# EAGLE design pca9535bo (EAGLE 6.2)
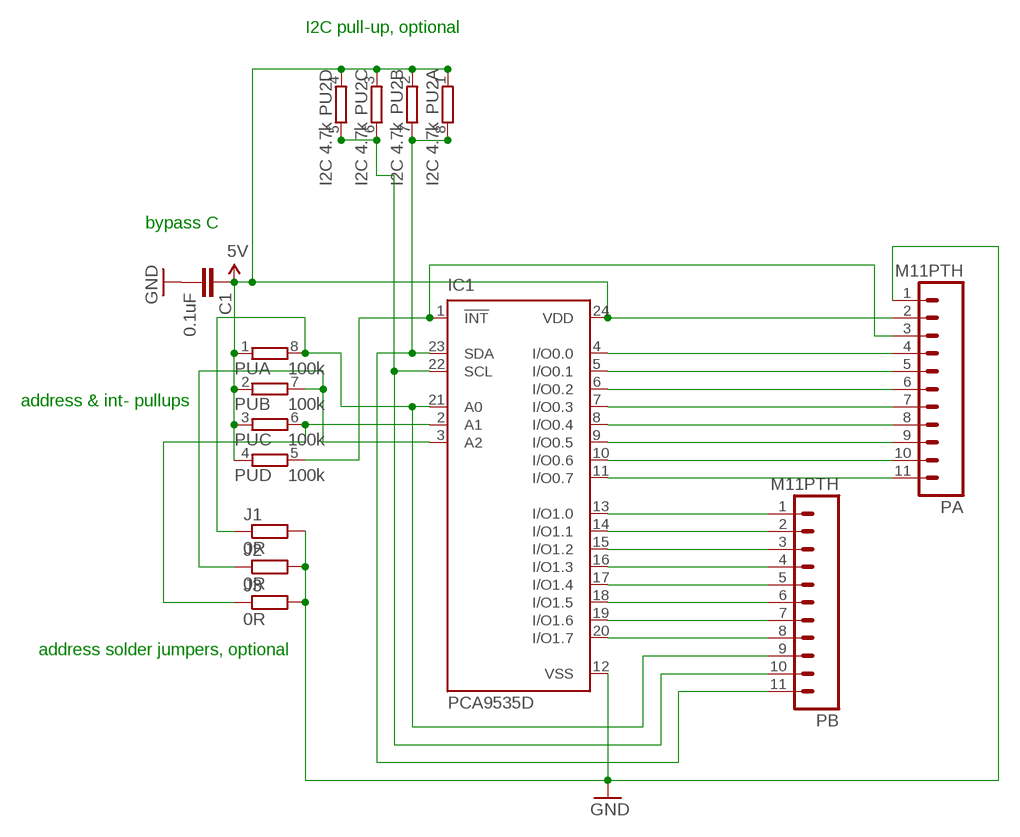
[diagram p0: schematic, sheet 1]

## Parts
C1  0.1uF  C-EUC0805K  [C0805K]
IC1  PCA9535D  PCA9555D  [SO24]
J1  0R  R-EU_R0603  [R0603]
J2  0R  R-EU_R0603  [R0603]
J3  0R  R-EU_R0603  [R0603]
PA  M11PTH  [1X11]
PB  M11PTH  [1X11]
PU  100k  4R-NCAY16  [CAY16]
PU2  I2C 4.7k  4R-NCAY16  [CAY16]

## Nets
5V: C1.1 IC1.24(VDD) PA.2 PU2.1 PU2.2 PU2.3 PU2.4 PU.1 PU.2 PU.3 PU.4
A0: IC1.21(A0) J1.1 PB.9 PU.8
A1: IC1.2(A1) J3.1 PU.6
A2: IC1.3(A2) J2.1 PU.7
GND: C1.2 IC1.12(VSS) J1.2 J2.2 J3.2 PA.1
INT-: IC1.1(!INT) PA.3 PU.5
PA0: IC1.4(I/O0.0) PA.4
PA1: IC1.5(I/O0.1) PA.5
PA2: IC1.6(I/O0.2) PA.6
PA3: IC1.7(I/O0.3) PA.7
PA4: IC1.8(I/O0.4) PA.8
PA5: IC1.9(I/O0.5) PA.9
PA6: IC1.10(I/O0.6) PA.10
PA7: IC1.11(I/O0.7) PA.11
PB0: IC1.13(I/O1.0) PB.1
PB1: IC1.14(I/O1.1) PB.2
PB2: IC1.15(I/O1.2) PB.3
PB3: IC1.16(I/O1.3) PB.4
PB4: IC1.17(I/O1.4) PB.5
PB5: IC1.18(I/O1.5) PB.6
PB6: IC1.19(I/O1.6) PB.7
PB7: IC1.20(I/O1.7) PB.8
SCL: IC1.22(SCL) PB.10 PU2.5 PU2.6
SDA: IC1.23(SDA) PB.11 PU2.7 PU2.8

## Notes on the sheet
- I2C pull-up, optional
- bypass C
- address & int- pullups
- address solder jumpers, optional

## Library data of the parts
C1 = rcl:C-EU: CAPACITOR, European symbol
IC1 = micro-philips:PCA9555: 16-bit I2C and SMBus I/O port with interrupt Source: PCA9555_5.pdf; MPN: PCA9555DW; OC_FARNELL: 1408295; OC_NEWARK: 63K6067
J1-J3 = resistor:R-EU_: RESISTOR, European symbol
PA PB = SparkFun:M11: Header 11 Standard 11-pin 0.1" header. Use with straight break away headers (SKU : PRT-00116), right angle break away headers (PRT-00553), swiss pins (PRT-00743), machine pins (PRT-00117), and female headers (PRT-00115).
PU PU2 = resistor-dil:4R-N: Array Chip Resistor Source: RS Component / Phycomp; OC_FARNELL: unknown; OC_NEWARK: unknown

## Net classes
1 power: width 0.152 mm

## Board
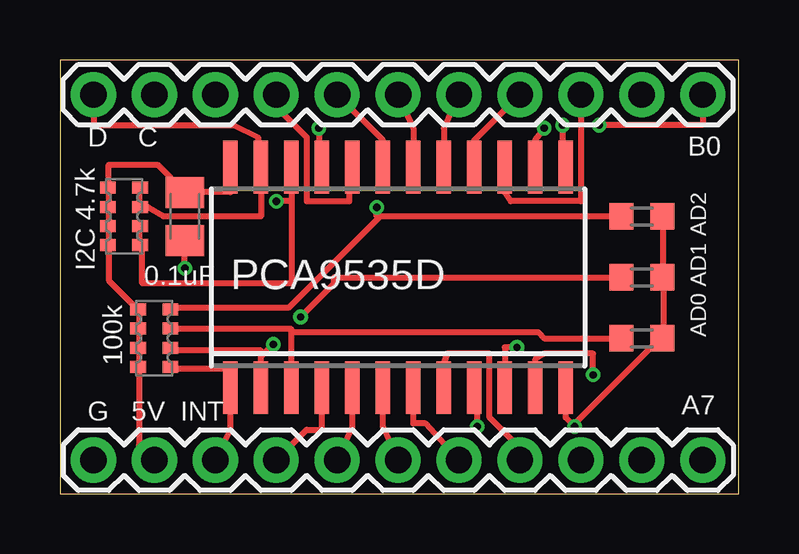
[diagram p1: board, top side]
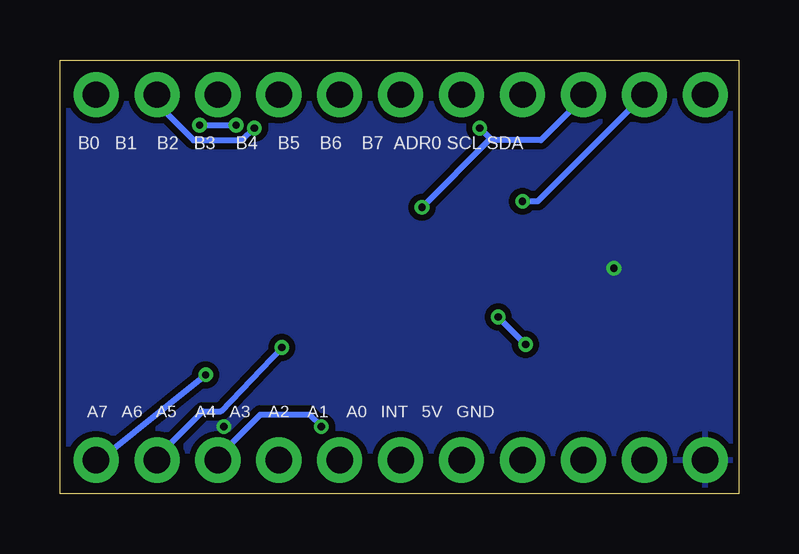
[diagram p2: board, bottom side, seen from below]

Size 28.3 x 18.09 mm. Coordinates in mm from the lower left corner, seen from the top.
Outline: 0,0 28.3,0 28.3,18.09 0,18.09 0,0
Copper layers (1*16): Top 0.035mm / dielectric 1.5mm / Bottom 0.035mm
Design rules: minimum track width 10mil, minimum drill 12mil, track to track 6mil, track to pad 6mil, pad to pad 6mil, via to via 6mil, smd to smd 0mil, copper to edge 10mil, drill to drill 10mil, minimum pad ring 10mil, minimum via ring 6mil, stop-mask expansion 2mil, vias tented up to drill 100mil, thermal gap 10mil

### Footprints (pad centres in the part's own frame; a part is rotated, then mirrored left to right if it is on the bottom)
C0805K = smd 1.3 x 1.6: 1 -1,0; 2 1,0
SO24 = smd 0.6 x 2.2: 1 -6.985,-4.6; 2 -5.715,-4.6; 3 -4.445,-4.6; 4 -3.175,-4.6; 5 -1.905,-4.6; 6 -0.635,-4.6; 7 0.635,-4.6; 8 1.905,-4.6; 9 3.175,-4.6; 10 4.445,-4.6; 11 5.715,-4.6; 12 6.985,-4.6; 13 6.985,4.6; 14 5.715,4.6; 15 4.445,4.6; 16 3.175,4.6; 17 1.905,4.6; 18 0.635,4.6; 19 -0.635,4.6; 20 -1.905,4.6; 21 -3.175,4.6; 22 -4.445,4.6; 23 -5.715,4.6; 24 -6.985,4.6
R0603 = smd 1 x 1.1: 1 -0.85,0; 2 0.85,0
1X11 = drill 1.1 pad 1.88: 1 0,0; 2 2.54,0; 3 5.08,0; 4 7.62,0; 5 10.16,0; 6 12.7,0; 7 15.24,0; 8 17.78,0; 9 20.32,0; 10 22.86,0; 11 25.4,0
CAY16 = smd 0.5 x 0.65: 1 -1.2,-0.675; 2 -0.4,-0.675; 3 0.4,-0.675; 4 1.2,-0.675; 5 1.2,0.675; 6 0.4,0.675; 7 -0.4,0.675; 8 -1.2,0.675

### Placement (x,y rotation side)
C1  5.21,11.56 270 top
IC1  14.1,9.02 0 top
J1  24.26,11.56 0 top
J2  24.26,6.48 0 top
J3  24.26,9.02 0 top
PA  1.4,1.4 0 top
PB  26.8,16.64 180 top
PU  3.94,6.48 270 top
PU2  2.67,11.56 270 top

### Tracks (layer width: path | path; a pad name or v marks a point on that pad's centre or on a via)
5V
  Top 0.254: 5.21,12.57 7.11,12.57 IC1.24 | 5.21,12.57 4.06,13.72 2.03,13.72 2.03,12.83 PU2.1 2.03,12.7 2.03,12.06 PU2.2 2.03,11.94 2.03,11.18 PU2.3 2.03,11.05 2.03,10.41 PU2.4 2.03,10.29 2.03,8.89 3.17,7.75 PU.1 3.3,7.62 3.3,6.99 PU.2 3.3,6.86 3.3,6.1 PU.3 3.3,5.97 3.3,5.33 PU.4 3.3,5.21 3.3,2.03 PA.2 | 5.21,12.57 C1.1
A0  (via drill 0.3)
  Top 0.254: v10.79,15.24 10.79,13.84 10.92,13.72 IC1.21 | 13.27,11.49 13.34,11.56 J1.1 | 13.27,11.49 9.53,7.75 4.7,7.75 PU.8 | v13.21,11.94 13.21,11.56 13.27,11.49
  Bottom 0.254: 10.35,14.8 10.29,14.73 8.26,14.73 6.48,16.51 PB.9 | 10.35,14.8 v10.79,15.24 | v13.21,11.94 10.35,14.8
A1  (via drill 0.3)
  Top 0.254: IC1.2 8.38,5.71 | 8.38,5.71 8.38,5.97 4.7,5.97 PU.6 | J3.1 11.43,9.02 11.43,8.76 v10.03,7.37 | 8.38,5.71 v8.89,6.22
  Bottom 0.254: v8.89,6.22 v10.03,7.37
A2
  Top 0.254: IC1.3 9.65,6.73 | 9.65,6.73 9.65,6.86 4.7,6.86 PU.7 | J2.1 20.19,6.48 19.94,6.73 9.65,6.73
GND  (via drill 0.3)
  Top 0.254: 25.15,9.02 25.15,6.48 J2.2 25.02,6.48 21.46,2.92 v21.46,2.79 21.08,3.17 IC1.12 | 25.15,9.02 25.15,11.56 J1.2 | 25.15,9.02 J3.2 | v5.21,9.4 C1.2
  pour Bottom (isolate 0.254): 0,18.03 0,0 28.32,0 28.32,18.16 0,18.16
INT-
  Top 0.254: PU.5 4.7,5.21 7.11,5.21 IC1.1 7.11,2.67 PA.3
PA0
  Top 0.254: IC1.4 10.92,2.67 10.29,2.67 PA.4
PA1
  Top 0.254: IC1.5 12.19,2.79 PA.5
PA2
  Top 0.254: IC1.6 13.46,2.79 PA.6
PA3
  Top 0.254: IC1.7 14.73,2.92 15.24,2.92 PA.7
PA4
  Top 0.254: IC1.8 16,5.46 16.13,5.84 17.91,5.84 17.91,3.17 19.18,1.91 PA.8
PA5  (via drill 0.3)
  Top 0.254: v17.4,2.79 17.4,4.19 17.27,4.32 IC1.9
  Bottom 0.254: v17.4,2.79 17.91,3.3 19.94,3.3 21.72,1.52 PA.9
PA6  (via drill 0.3)
  Top 0.254: IC1.10 18.54,6.1 v19.05,6.1
  Bottom 0.254: v19.05,6.1 21.59,3.43 22.35,3.43 24.26,1.52 PA.10
PA7  (via drill 0.3)
  Top 0.254: IC1.11 19.81,5.59 20.19,5.84 22.23,5.84 v22.23,4.95
  Bottom 0.254: v22.23,4.95 26.67,1.4 PA.11
PB0  (via drill 0.3)
  Top 0.254: v20.95,15.37 20.95,13.84 21.08,13.72 IC1.13 | v22.48,15.37 26.8,15.37 PB.1
  Bottom 0.254: v22.48,15.37 v20.95,15.37
PB1  (via drill 0.3)
  Top 0.254: IC1.14 19.81,14.73 v20.19,15.24
  Bottom 0.254: v20.19,15.24 20.7,14.73 22.73,14.73 24.26,16.26 PB.2
PB2
  Top 0.254: IC1.15 18.54,12.57 18.8,12.19 21.72,12.19 PB.3
PB3
  Top 0.254: IC1.16 17.27,14.73 PB.4
PB4
  Top 0.254: IC1.17 16,15.24 PB.5
PB5
  Top 0.254: IC1.18 14.73,15.24 PB.6
PB6
  Top 0.254: IC1.19 13.46,14.73 PB.7
PB7
  Top 0.254: PB.8 9.02,16.13 10.29,14.86 10.29,12.19 12.06,12.19 12.06,12.7 12.19,13.59 IC1.20
SCL  (via drill 0.3)
  Top 0.254: PU2.6 3.3,11.05 3.3,10.41 PU2.5 3.43,10.29 3.43,8.76 9.65,8.76 9.65,12.19 | IC1.22 9.65,12.19 | 9.65,12.19 v9.02,12.19
  Bottom 0.254: PB.10 8.38,12.19 v9.02,12.19
SDA
  Top 0.254: PU2.8 3.3,12.7 3.3,12.06 PU2.7 3.43,11.94 3.68,11.94 4.32,11.56 8.38,11.56 IC1.23 8.38,13.72 8.26,14.61 8.26,14.86 7.24,15.37 1.4,15.37 PB.11

### Text on the board
tNames: D C | B0 | AD0 AD1 AD2 | G 5V INT | A7
bNames: B0 B1 B2 B3 B4 B5 B6 B7 ADR0 SCL SDA | A7 A6 A5 A4 A3 A2 A1 A0 INT 5V GND